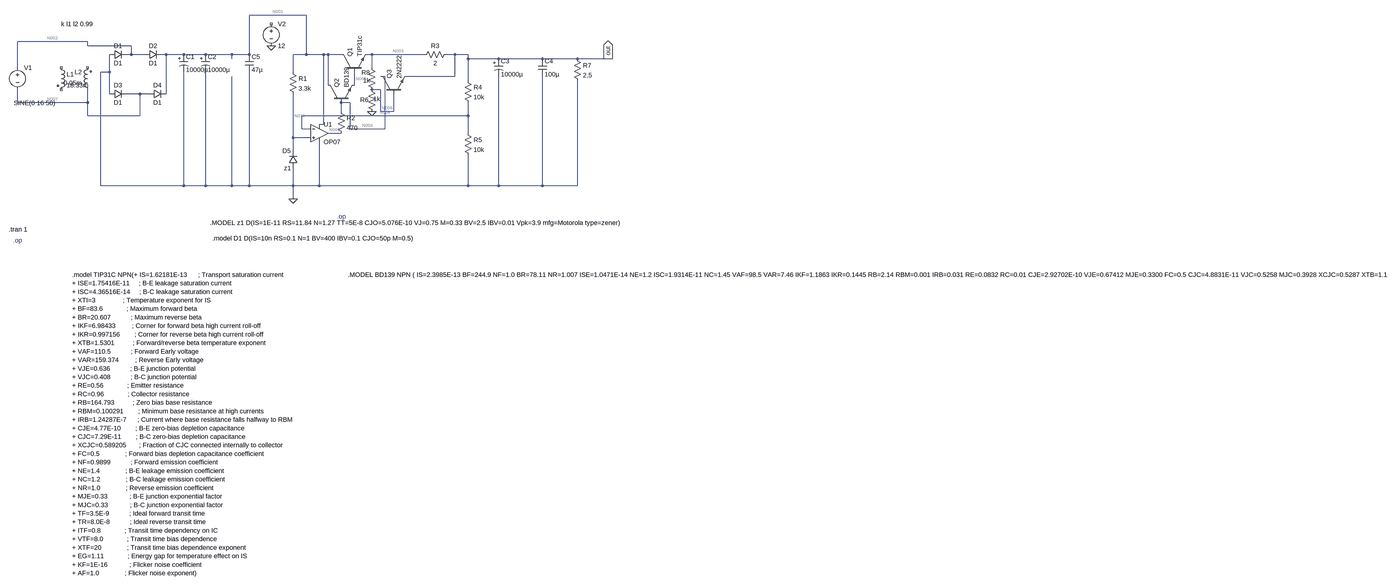
[diagram p0: schematic linerpowersupply 5v_2A.asc, whole sheet]
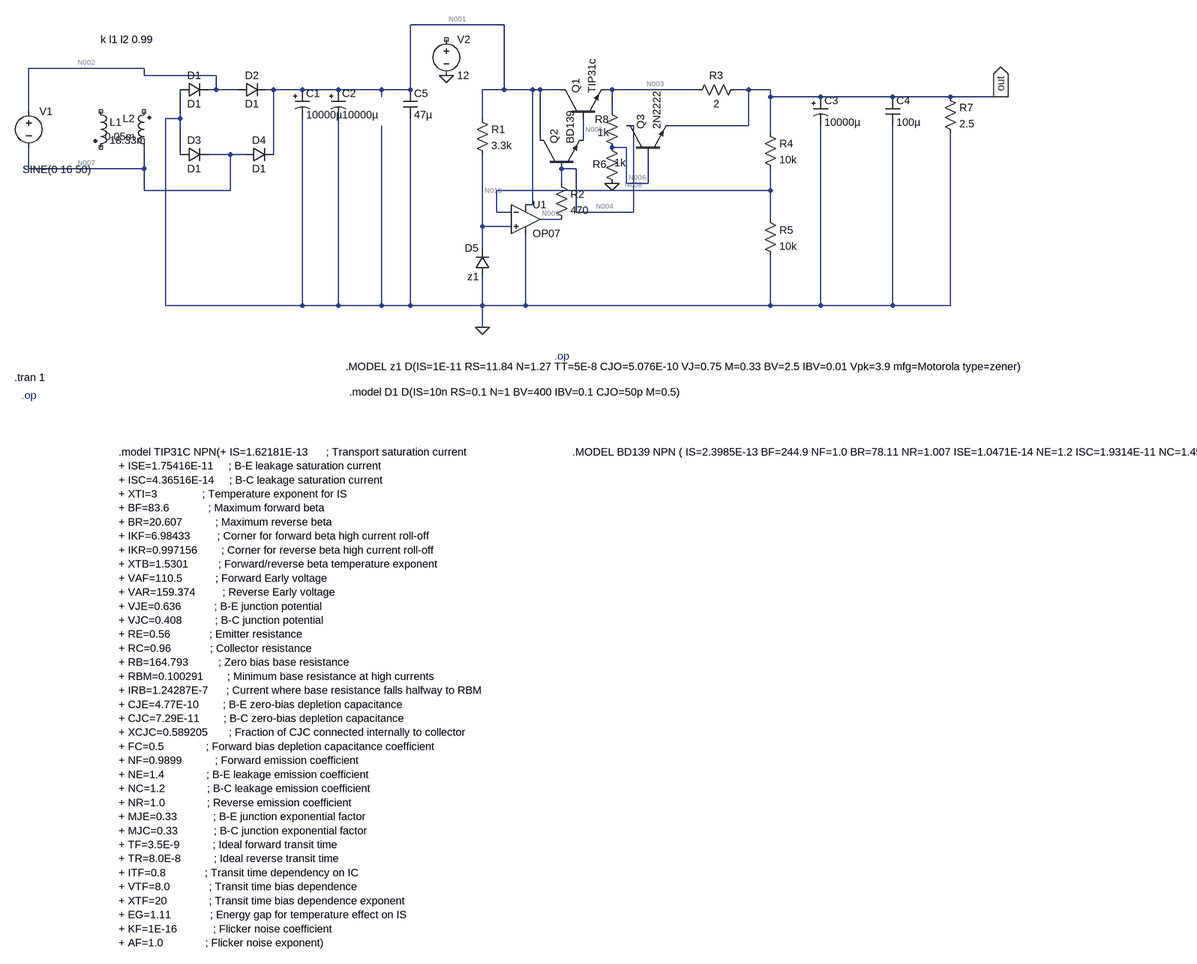
[diagram p1: schematic linerpowersupply 5v_2A.asc, part, row 1 of 1, column 1 of 2]
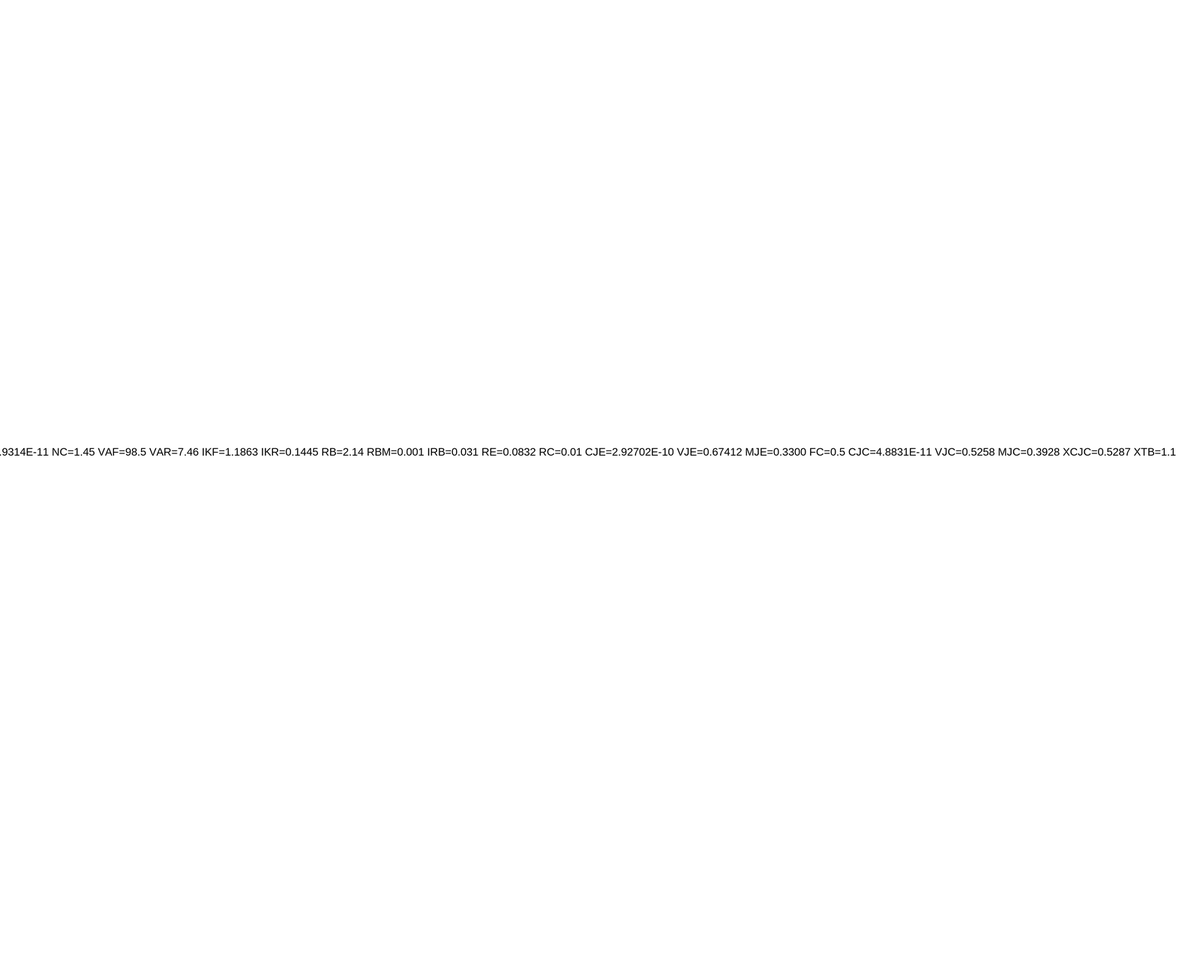
[diagram p2: schematic linerpowersupply 5v_2A.asc, part, row 1 of 1, column 2 of 2]
linerpowersupply 5v_2A.asc, the LTspice schematic file:
Version 4
SHEET 1 7856 29644
WIRE 736 -384 528 -384
WIRE -64 -288 -320 -288
WIRE -64 -272 -64 -288
WIRE 96 -272 -64 -272
WIRE 96 -240 96 -272
WIRE 96 -240 80 -240
WIRE 144 -240 96 -240
WIRE 224 -240 208 -240
WIRE 288 -240 224 -240
WIRE 368 -240 288 -240
WIRE 464 -240 368 -240
WIRE 528 -240 528 -384
WIRE 528 -240 464 -240
WIRE 736 -240 736 -384
WIRE 736 -240 688 -240
WIRE 800 -240 736 -240
WIRE 816 -240 800 -240
WIRE 864 -240 816 -240
WIRE 976 -240 960 -240
WIRE 1168 -240 976 -240
WIRE 1280 -240 1248 -240
WIRE 1328 -240 1280 -240
WIRE 464 -224 464 -240
WIRE 1328 -224 1328 -240
WIRE 1440 -224 1328 -224
WIRE 1600 -224 1440 -224
WIRE 1728 -224 1600 -224
WIRE 1840 -224 1728 -224
WIRE 1856 -224 1840 -224
WIRE -320 -192 -320 -288
WIRE 976 -192 976 -240
WIRE 16 -176 16 -240
WIRE 16 -176 -16 -176
WIRE 688 -176 688 -240
WIRE 1024 -160 1008 -160
WIRE 1280 -160 1280 -240
WIRE 1280 -160 1104 -160
WIRE 1328 -144 1328 -224
WIRE 816 -128 816 -240
WIRE 912 -128 912 -176
WIRE 1008 -112 976 -112
WIRE 16 -96 16 -176
WIRE 128 -96 80 -96
WIRE 160 -96 128 -96
WIRE 224 -96 224 -240
WIRE -320 -64 -320 -112
WIRE -64 -64 -64 -112
WIRE -64 -64 -320 -64
WIRE 896 -64 864 -64
WIRE 864 -32 864 -64
WIRE 1008 -32 1008 -112
WIRE 1056 -32 1056 -96
WIRE 1056 -32 1008 -32
WIRE -64 -16 -64 -64
WIRE 128 -16 128 -96
WIRE 128 -16 -64 -16
WIRE 1328 -16 1328 -64
WIRE 1328 -16 720 -16
WIRE 800 16 800 -240
WIRE 800 16 784 16
WIRE 720 32 720 -16
WIRE 752 32 720 32
WIRE 896 32 896 -64
WIRE 1024 32 1024 -160
WIRE 1024 32 896 32
WIRE 864 48 816 48
WIRE 1328 48 1328 -16
WIRE 688 64 688 -96
WIRE 752 64 688 64
WIRE 688 112 688 64
WIRE -16 240 -16 -176
WIRE 288 240 288 -176
WIRE 288 240 -16 240
WIRE 368 240 368 -176
WIRE 368 240 288 240
WIRE 464 240 464 -160
WIRE 464 240 368 240
WIRE 528 240 528 -176
WIRE 528 240 464 240
WIRE 688 240 688 176
WIRE 688 240 528 240
WIRE 784 240 784 80
WIRE 784 240 688 240
WIRE 1328 240 1328 128
WIRE 1328 240 784 240
WIRE 1440 240 1440 -160
WIRE 1440 240 1328 240
WIRE 1600 240 1600 -160
WIRE 1600 240 1440 240
WIRE 1728 240 1728 -144
WIRE 1728 240 1600 240
WIRE 688 288 688 240
FLAG 688 288 0
FLAG 1840 -224 out
IOPIN 1840 -224 Out
FLAG 976 -32 0
FLAG 608 -272 0
DATAFLAG 1328 240 ""
SYMBOL ind2 -176 -208 R0
SYMATTR InstName L1
SYMATTR Value 18.33m
SYMATTR Type ind
SYMATTR SpiceLine Rser=5
SYMBOL ind2 -48 -96 R180
WINDOW 0 36 80 Left 2
WINDOW 3 36 40 Left 2
SYMATTR InstName L2
SYMATTR Value 0.05m
SYMATTR Type ind
SYMATTR SpiceLine Rser=0.2
SYMBOL voltage -320 -208 R0
WINDOW 123 0 0 Left 0
WINDOW 39 0 0 Left 0
WINDOW 3 -14 145 Left 2
SYMATTR Value SINE(0 16 50)
SYMATTR InstName V1
SYMBOL diode 16 -224 R270
WINDOW 0 32 32 VTop 2
WINDOW 3 0 32 VBottom 2
SYMATTR InstName D1
SYMATTR Value D1
SYMBOL diode 144 -224 R270
WINDOW 0 32 32 VTop 2
WINDOW 3 0 32 VBottom 2
SYMATTR InstName D2
SYMATTR Value D1
SYMBOL diode 16 -80 R270
WINDOW 0 32 32 VTop 2
WINDOW 3 0 32 VBottom 2
SYMATTR InstName D3
SYMATTR Value D1
SYMBOL diode 160 -80 R270
WINDOW 0 32 32 VTop 2
WINDOW 3 0 32 VBottom 2
SYMATTR InstName D4
SYMATTR Value D1
SYMBOL polcap 272 -240 R0
WINDOW 3 24 56 Left 2
SYMATTR Value 10000µ
SYMATTR InstName C1
SYMATTR Description Capacitor
SYMATTR Type cap
SYMATTR SpiceLine V=25 Irms=3.96 Rser=0.0225 Lser=41.2n
SYMBOL polcap 352 -240 R0
WINDOW 3 24 56 Left 2
SYMATTR Value 10000µ
SYMATTR InstName C2
SYMATTR Description Capacitor
SYMATTR Type cap
SYMATTR SpiceLine V=25 Irms=3.96 Rser=0.0225 Lser=41.2n
SYMBOL npn 864 -176 R270
SYMATTR InstName Q1
SYMATTR Value TIP31c
SYMBOL npn 816 -64 R270
SYMATTR InstName Q2
SYMATTR Value BD139
SYMBOL OpAmps\\OP07 784 -16 R0
SYMATTR InstName U1
SYMBOL diode 704 176 R180
WINDOW 0 24 64 Left 2
WINDOW 3 24 0 Left 2
SYMATTR InstName D5
SYMATTR Value z1
SYMBOL res 672 -192 R0
SYMATTR InstName R1
SYMATTR Value 3.3k
SYMBOL res 848 -48 R0
SYMATTR InstName R2
SYMATTR Value 470
SYMBOL res 1264 -256 R90
WINDOW 0 0 56 VBottom 2
WINDOW 3 32 56 VTop 2
SYMATTR InstName R3
SYMATTR Value 2
SYMBOL res 1312 -160 R0
SYMATTR InstName R4
SYMATTR Value 10k
SYMBOL res 1312 32 R0
SYMATTR InstName R5
SYMATTR Value 10k
SYMBOL npn 1008 -96 R270
SYMATTR InstName Q3
SYMATTR Value 2N2222
SYMBOL polcap 1424 -224 R0
WINDOW 3 24 56 Left 2
SYMATTR Value 10000µ
SYMATTR InstName C3
SYMATTR Description Capacitor
SYMATTR Type cap
SYMATTR SpiceLine V=16 Irms=92m Rser=0.362 Lser=20.721n
SYMBOL cap 1584 -224 R0
SYMATTR InstName C4
SYMATTR Value 100µ
SYMBOL res 1712 -240 R0
SYMATTR InstName R7
SYMATTR Value 2.5
SYMBOL cap 512 -240 R0
SYMATTR InstName C5
SYMATTR Value 47µ
SYMBOL res 960 -128 R0
WINDOW 0 -27 54 Left 2
WINDOW 3 21 50 Left 2
SYMATTR InstName R6
SYMATTR Value 1k
SYMBOL res 960 -208 R0
WINDOW 0 -22 34 Left 2
WINDOW 3 -16 63 Left 2
SYMATTR InstName R8
SYMATTR Value 1k
SYMBOL voltage 608 -368 R0
WINDOW 123 0 0 Left 0
WINDOW 39 0 0 Left 0
SYMATTR InstName V2
SYMATTR Value 12
TEXT 384 376 Left 2 !.MODEL z1 D(IS=1E-11 RS=11.84 N=1.27 TT=5E-8 CJO=5.076E-10 VJ=0.75 M=0.33 BV=2.5 IBV=0.01 Vpk=3.9 mfg=Motorola type=zener)
TEXT -352 400 Left 2 !.tran 1
TEXT 392 432 Left 2 !.model D1 D(IS=10n RS=0.1 N=1 BV=400 IBV=0.1 CJO=50p M=0.5)
TEXT -160 -352 Left 2 !k l1 l2 0.99
TEXT -120 592 Left 2 !.model TIP31C NPN(+ IS=1.62181E-13      ; Transport saturation current\n+ ISE=1.75416E-11     ; B-E leakage saturation current  \n+ ISC=4.36516E-14     ; B-C leakage saturation current\n+ XTI=3               ; Temperature exponent for IS\n+ BF=83.6             ; Maximum forward beta\n+ BR=20.607           ; Maximum reverse beta  \n+ IKF=6.98433         ; Corner for forward beta high current roll-off\n+ IKR=0.997156        ; Corner for reverse beta high current roll-off\n+ XTB=1.5301          ; Forward/reverse beta temperature exponent\n+ VAF=110.5           ; Forward Early voltage\n+ VAR=159.374         ; Reverse Early voltage\n+ VJE=0.636           ; B-E junction potential\n+ VJC=0.408           ; B-C junction potential  \n+ RE=0.56             ; Emitter resistance\n+ RC=0.96             ; Collector resistance\n+ RB=164.793          ; Zero bias base resistance\n+ RBM=0.100291        ; Minimum base resistance at high currents\n+ IRB=1.24287E-7      ; Current where base resistance falls halfway to RBM\n+ CJE=4.77E-10        ; B-E zero-bias depletion capacitance\n+ CJC=7.29E-11        ; B-C zero-bias depletion capacitance\n+ XCJC=0.589205       ; Fraction of CJC connected internally to collector\n+ FC=0.5              ; Forward bias depletion capacitance coefficient\n+ NF=0.9899           ; Forward emission coefficient  \n+ NE=1.4              ; B-E leakage emission coefficient\n+ NC=1.2              ; B-C leakage emission coefficient\n+ NR=1.0              ; Reverse emission coefficient\n+ MJE=0.33            ; B-E junction exponential factor\n+ MJC=0.33            ; B-C junction exponential factor  \n+ TF=3.5E-9           ; Ideal forward transit time\n+ TR=8.0E-8           ; Ideal reverse transit time\n+ ITF=0.8             ; Transit time dependency on IC\n+ VTF=8.0             ; Transit time bias dependence\n+ XTF=20              ; Transit time bias dependence exponent\n+ EG=1.11             ; Energy gap for temperature effect on IS\n+ KF=1E-16            ; Flicker noise coefficient\n+ AF=1.0              ; Flicker noise exponent)
TEXT 848 352 Left 2 ;.op
TEXT 888 592 Left 2 !.MODEL BD139 NPN ( IS=2.3985E-13 BF=244.9 NF=1.0 BR=78.11 NR=1.007 ISE=1.0471E-14 NE=1.2 ISC=1.9314E-11 NC=1.45 VAF=98.5 VAR=7.46 IKF=1.1863 IKR=0.1445 RB=2.14 RBM=0.001 IRB=0.031 RE=0.0832 RC=0.01 CJE=2.92702E-10 VJE=0.67412 MJE=0.3300 FC=0.5 CJC=4.8831E-11 VJC=0.5258 MJC=0.3928 XCJC=0.5287 XTB=1.1398 EG=1.2105 XTI=3.0 Vceo=80 Icrating=3 mfg=fairchild)
TEXT -336 440 Left 2 ;.op

The netlist it stands for:
* linerpowersupply 5v_2A.asc
L1 NC_01 NC_02 18.33m Rser=5
L2 N007 NC_03 0.05m Rser=0.2
V1 N002 N007 SINE(0 16 50)
D1 0 N002 D1
D2 N002 N001 D1
D3 0 N007 D1
D4 N007 N001 D1
C1 N001 0 10000µ V=25 Irms=3.96 Rser=0.0225 Lser=41.2n
C2 N001 0 10000µ V=25 Irms=3.96 Rser=0.0225 Lser=41.2n
Q1 N001 N005 N003 0 TIP31c
Q2 N001 N004 N005 0 BD139
XU1 N010 N008 N001 0 N009 LT1001  ; OP07, pins In+ In- V+ V- OUT
D5 0 N010 z1
R1 N001 N010 3.3k
R2 N004 N009 470
R3 out N003 2
R4 out N008 10k
R5 N008 0 10k
Q3 N004 N006 out 0 2N2222
C3 out 0 10000µ V=16 Irms=92m Rser=0.362 Lser=20.721n
C4 out 0 100µ
R7 out 0 2.5
C5 N001 0 47µ
R6 N006 0 1k
R8 N003 N006 1k
V2 NC_04 0 12
.model D D
.lib standard.dio
.model NPN NPN
.model PNP PNP
.lib standard.bjt
.MODEL z1 D(IS=1E-11 RS=11.84 N=1.27 TT=5E-8 CJO=5.076E-10 VJ=0.75 M=0.33 BV=2.5 IBV=0.01 Vpk=3.9 mfg=Motorola type=zener)
.tran 1
.model D1 D(IS=10n RS=0.1 N=1 BV=400 IBV=0.1 CJO=50p M=0.5)
k l1 l2 0.99
.model TIP31C NPN(+ IS=1.62181E-13      ; Transport saturation current
+ ISE=1.75416E-11     ; B-E leakage saturation current
+ ISC=4.36516E-14     ; B-C leakage saturation current
+ XTI=3               ; Temperature exponent for IS
+ BF=83.6             ; Maximum forward beta
+ BR=20.607           ; Maximum reverse beta
+ IKF=6.98433         ; Corner for forward beta high current roll-off
+ IKR=0.997156        ; Corner for reverse beta high current roll-off
+ XTB=1.5301          ; Forward/reverse beta temperature exponent
+ VAF=110.5           ; Forward Early voltage
+ VAR=159.374         ; Reverse Early voltage
+ VJE=0.636           ; B-E junction potential
+ VJC=0.408           ; B-C junction potential
+ RE=0.56             ; Emitter resistance
+ RC=0.96             ; Collector resistance
+ RB=164.793          ; Zero bias base resistance
+ RBM=0.100291        ; Minimum base resistance at high currents
+ IRB=1.24287E-7      ; Current where base resistance falls halfway to RBM
+ CJE=4.77E-10        ; B-E zero-bias depletion capacitance
+ CJC=7.29E-11        ; B-C zero-bias depletion capacitance
+ XCJC=0.589205       ; Fraction of CJC connected internally to collector
+ FC=0.5              ; Forward bias depletion capacitance coefficient
+ NF=0.9899           ; Forward emission coefficient
+ NE=1.4              ; B-E leakage emission coefficient
+ NC=1.2              ; B-C leakage emission coefficient
+ NR=1.0              ; Reverse emission coefficient
+ MJE=0.33            ; B-E junction exponential factor
+ MJC=0.33            ; B-C junction exponential factor
+ TF=3.5E-9           ; Ideal forward transit time
+ TR=8.0E-8           ; Ideal reverse transit time
+ ITF=0.8             ; Transit time dependency on IC
+ VTF=8.0             ; Transit time bias dependence
+ XTF=20              ; Transit time bias dependence exponent
+ EG=1.11             ; Energy gap for temperature effect on IS
+ KF=1E-16            ; Flicker noise coefficient
+ AF=1.0              ; Flicker noise exponent)
* .op
.MODEL BD139 NPN ( IS=2.3985E-13 BF=244.9 NF=1.0 BR=78.11 NR=1.007 ISE=1.0471E-14 NE=1.2 ISC=1.9314E-11 NC=1.45 VAF=98.5 VAR=7.46 IKF=1.1863 IKR=0.1445 RB=2.14 RBM=0.001 IRB=0.031 RE=0.0832 RC=0.01 CJE=2.92702E-10 VJE=0.67412 MJE=0.3300 FC=0.5 CJC=4.8831E-11 VJC=0.5258 MJC=0.3928 XCJC=0.5287 XTB=1.1398 EG=1.2105 XTI=3.0 Vceo=80 Icrating=3 mfg=fairchild)
* .op
.lib LTC.lib
.backanno
.end

* Results of the author's LTspice run, read from the files saved beside the schematic
* Operating Point, zero values left out:
*   V(n007) = 309.5 mV
*   V(n002) = 309.5 mV
*   V(n001) = 619 mV
*   V(n005) = 295.8 mV
*   V(n003) = 364.6 nV
*   V(n004) = 619 mV
*   V(n008) = 41.88 µV
*   V(n010) = 619 mV
*   V(n009) = 619 mV
*   V(out) = 207.2 nV
*   V(n006) = 182.6 nV
*   Ic(Q1) = 16.87 nA
*   Ib(Q1) = 62.02 nA
*   Ie(Q1) = -78.9 nA
*   Ic(Q2) = 61.41 nA
*   Ib(Q2) = 611.5 pA
*   Ie(Q2) = -62.02 nA
*   I(D1) = -10 nA
*   I(D2) = -10 nA
*   I(D3) = -10 nA
*   I(D4) = -10 nA
*   I(D5) = -10.62 pA
*   I(R1) = 8.367 nA
*   I(R2) = -612.2 pA
*   I(R3) = -78.71 nA
*   I(R4) = -4.168 nA
*   I(R5) = 4.188 nA
*   I(R7) = 82.88 nA
*   I(R6) = 182.6 pA
*   I(R8) = 182 pA
*   Ix(u1:1) = 8.356 nA
*   Ix(u1:2) = -8.356 nA
*   Ix(u1:3) = -106.7 nA
*   Ix(u1:4) = -87.74 nA
*   Ix(u1:5) = -612.8 pA
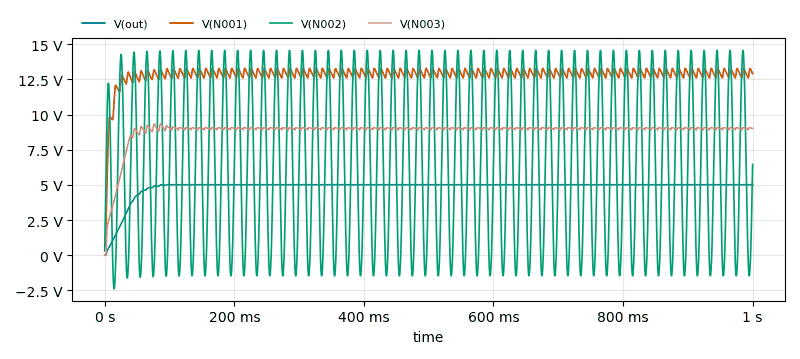
[diagram p3: Transient Analysis of linerpowersupply 5v_2A.asc, plotted from the saved traces]
* Transient Analysis, 1 run:
*   V(out): min 0 V, max 5.02 V, average 4.863 V, rms 4.91 V, last 5.015 V
*   V(N001): min 619 mV, max 13.3 V, average 12.85 V, rms 12.88 V, last 12.92 V
*   V(N002): min -2.389 V, max 14.57 V, average 6.428 V, rms 8.568 V, last 6.459 V
*   V(N003): min 0 V, max 9.361 V, average 8.854 V, rms 8.904 V, last 9.024 V